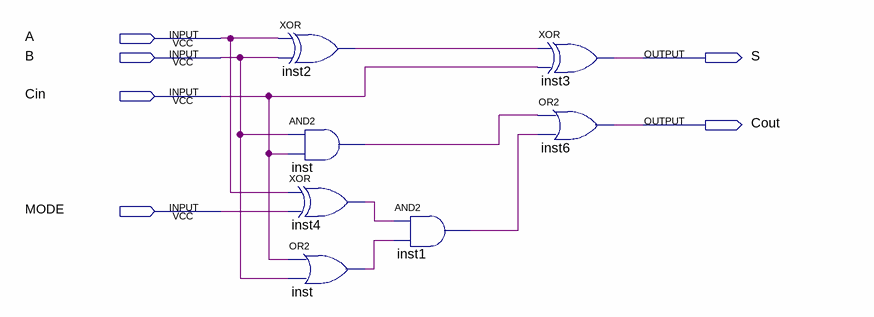
[diagram p0: schematic sheet]
// Quartus schematic adder_subtractor_1b.bdf as structural Verilog: 7 symbols, 6 pins
module adder_subtractor_1b (
  input  A,
  input  B,
  input  Cin,
  input  MODE,
  output S,
  output Cout
);

  wire inst1_out, inst2_out, inst4_out, inst_out, inst_out_2;

  xor inst2 (inst2_out, A, B);
  and inst (inst_out_2, B, Cin);
  xor inst4 (inst4_out, A, MODE);
  or inst_dup2 (inst_out, Cin, B);
  and inst1 (inst1_out, inst4_out, inst_out);
  xor inst3 (S, inst2_out, Cin);
  or inst6 (Cout, inst_out_2, inst1_out);
endmodule
